# Altium schematic sheet [11]-FPGA_Bank_4_Interface.SchDoc
size A3
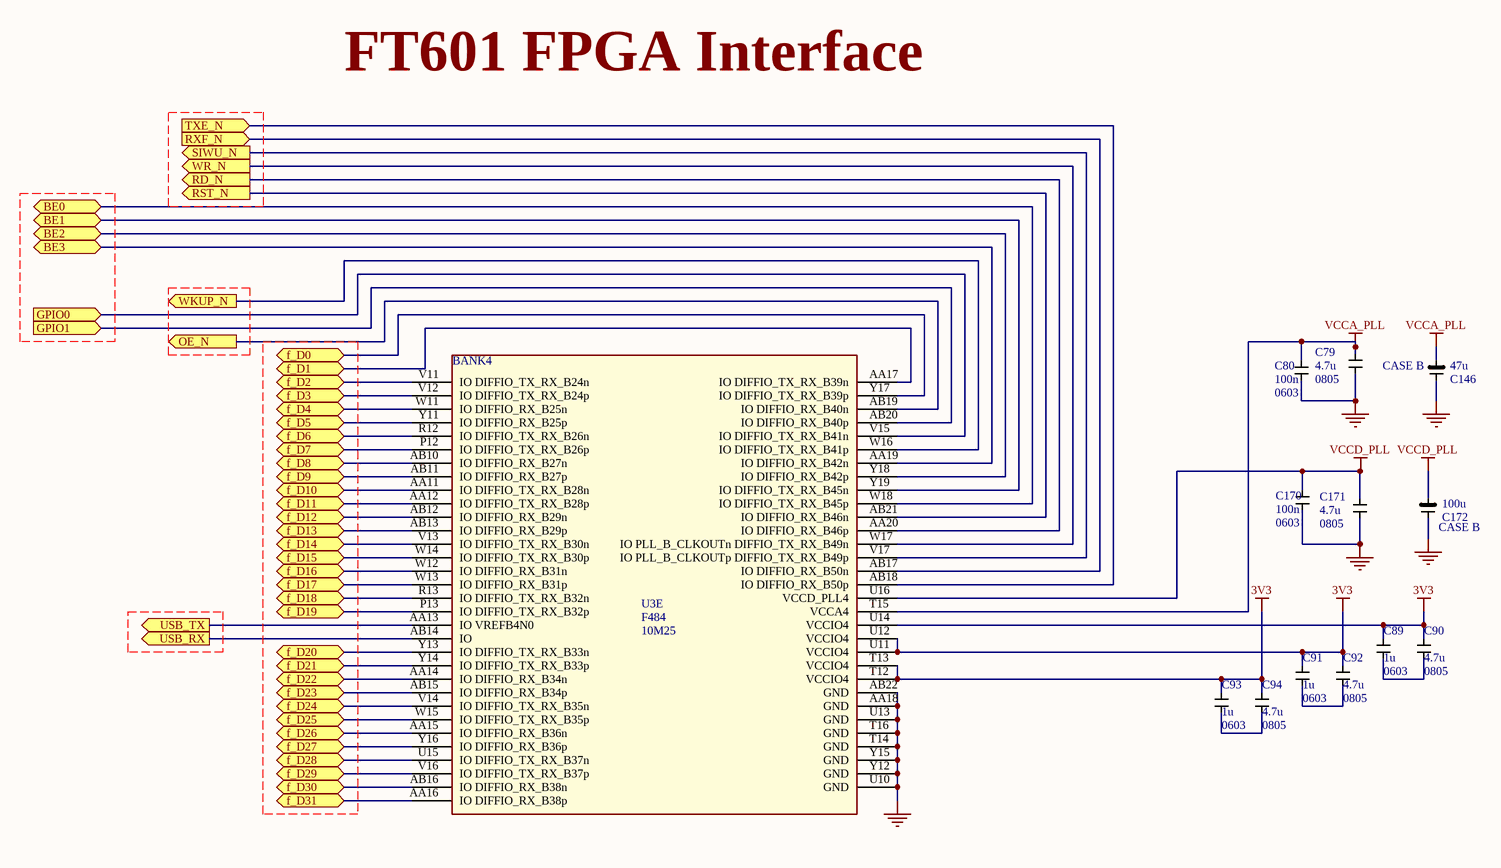
[diagram p0: [11]-FPGA_Bank_4_Interface.SchDoc]

## Parts
C79  4.7u  PCB footprint: 0805
C80  100n  PCB Layer:: 0603  [*0603]
C89  1u  PCB Layer:: 0603  [*0603]
C90  4.7u  PCB Package: 0805  [*CAPC2013X140N]
C91  1u  PCB Layer:: 0603  [*0603]
C92  4.7u  PCB Package: 0805  [*CAPC2013X140N]
C93  1u  PCB Layer:: 0603  [*0603]
C94  4.7u  PCB Package: 0805  [*CAPC2013X140N]
C146  47u  CASE: CASE B  [CAPC3529X21N]
C170  100n  PCB Layer:: 0603  [*0603]
C171  4.7u  PCB footprint: 0805
C172  100u  CASE: CASE B  [CAPC3529X21N]
U3  10M25  Package Type: F484  [*BGA484C100P22X22_2300X2300X200N]  (part E of 9)

## Ports
BE0 (bidir), BE1 (bidir), BE2 (bidir), BE3 (bidir), f_D0 (bidir), f_D1 (bidir), f_D2 (bidir), f_D3 (bidir), f_D4 (bidir), f_D5 (bidir), f_D6 (bidir), f_D7 (bidir), f_D8 (bidir), f_D9 (bidir), f_D10 (bidir), f_D11 (bidir), f_D12 (bidir), f_D13 (bidir), f_D14 (bidir), f_D15 (bidir), f_D16 (bidir), f_D17 (bidir), f_D18 (bidir), f_D19 (bidir), f_D20 (bidir), f_D21 (bidir), f_D22 (bidir), f_D23 (bidir), f_D24 (bidir), f_D25 (bidir), f_D26 (bidir), f_D27 (bidir), f_D28 (bidir), f_D29 (bidir), f_D30 (bidir), f_D31 (bidir), GPIO0 (in), GPIO1 (in), OE_N (out), RD_N (out), RST_N (out), RXF_N (in), SIWU_N (out), TXE_N (in), USB_RX (out), USB_TX (out), WKUP_N (out), WR_N (out)

## Nets
3V3: C89.2 C90.2 C91.2 C92.2 C93.2 C94.2 U3.T12(VCCIO4) U3.T13(VCCIO4) U3.U11(VCCIO4) U3.U12(VCCIO4) U3.U14(VCCIO4)
GND: C79.1 C80.1 C146.2 C170.1 C171.1 C172.2 U3.AA18(GND) U3.AB22(GND) U3.T14(GND) U3.T16(GND) U3.U10(GND) U3.U13(GND) U3.Y12(GND) U3.Y15(GND)
VCCA_PLL: C79.2 C80.2 C146.1 U3.T15(VCCA4)
VCCD_PLL: C170.2 C171.2 C172.1 U3.U16(VCCD_PLL4)
BE0: U3.W18(IO_DIFFIO_TX_RX_B45p) ; port BE0
BE1: U3.Y19(IO_DIFFIO_TX_RX_B45n) ; port BE1
BE2: U3.Y18(IO_DIFFIO_RX_B42p) ; port BE2
BE3: U3.AA19(IO_DIFFIO_RX_B42n) ; port BE3
f_D0: U3.Y17(IO_DIFFIO_TX_RX_B39p) ; port f_D0
f_D1: U3.AA17(IO_DIFFIO_TX_RX_B39n) ; port f_D1
f_D2: U3.V11(IO_DIFFIO_TX_RX_B24n) ; port f_D2
f_D3: U3.V12(IO_DIFFIO_TX_RX_B24p) ; port f_D3
f_D4: U3.W11(IO_DIFFIO_RX_B25n) ; port f_D4
f_D5: U3.Y11(IO_DIFFIO_RX_B25p) ; port f_D5
f_D6: U3.R12(IO_DIFFIO_TX_RX_B26n) ; port f_D6
f_D7: U3.P12(IO_DIFFIO_TX_RX_B26p) ; port f_D7
f_D8: U3.AB10(IO_DIFFIO_RX_B27n) ; port f_D8
f_D9: U3.AB11(IO_DIFFIO_RX_B27p) ; port f_D9
f_D10: U3.AA11(IO_DIFFIO_TX_RX_B28n) ; port f_D10
f_D11: U3.AA12(IO_DIFFIO_TX_RX_B28p) ; port f_D11
f_D12: U3.AB12(IO_DIFFIO_RX_B29n) ; port f_D12
f_D13: U3.AB13(IO_DIFFIO_RX_B29p) ; port f_D13
f_D14: U3.V13(IO_DIFFIO_TX_RX_B30n) ; port f_D14
f_D15: U3.W14(IO_DIFFIO_TX_RX_B30p) ; port f_D15
f_D16: U3.W12(IO_DIFFIO_RX_B31n) ; port f_D16
f_D17: U3.W13(IO_DIFFIO_RX_B31p) ; port f_D17
f_D18: U3.R13(IO_DIFFIO_TX_RX_B32n) ; port f_D18
f_D19: U3.P13(IO_DIFFIO_TX_RX_B32p) ; port f_D19
f_D20: U3.Y13(IO_DIFFIO_TX_RX_B33n) ; port f_D20
f_D21: U3.Y14(IO_DIFFIO_TX_RX_B33p) ; port f_D21
f_D22: U3.AA14(IO_DIFFIO_RX_B34n) ; port f_D22
f_D23: U3.AB15(IO_DIFFIO_RX_B34p) ; port f_D23
f_D24: U3.V14(IO_DIFFIO_TX_RX_B35n) ; port f_D24
f_D25: U3.W15(IO_DIFFIO_TX_RX_B35p) ; port f_D25
f_D26: U3.AA15(IO_DIFFIO_RX_B36n) ; port f_D26
f_D27: U3.Y16(IO_DIFFIO_RX_B36p) ; port f_D27
f_D28: U3.U15(IO_DIFFIO_TX_RX_B37n) ; port f_D28
f_D29: U3.V16(IO_DIFFIO_TX_RX_B37p) ; port f_D29
f_D30: U3.AB16(IO_DIFFIO_RX_B38n) ; port f_D30
f_D31: U3.AA16(IO_DIFFIO_RX_B38p) ; port f_D31
GPIO0: U3.V15(IO_DIFFIO_TX_RX_B41n) ; port GPIO0
GPIO1: U3.AB20(IO_DIFFIO_RX_B40p) ; port GPIO1
OE_N: U3.AB19(IO_DIFFIO_RX_B40n) ; port OE_N
RD_N: U3.AA20(IO_DIFFIO_RX_B46p) ; port RD_N
RST_N: U3.AB21(IO_DIFFIO_RX_B46n) ; port RST_N
RXF_N: U3.AB17(IO_DIFFIO_RX_B50n) ; port RXF_N
SIWU_N: U3.V17(IO_PLL_B_CLKOUTp_DIFFIO_TX_RX_B49p) ; port SIWU_N
TXE_N: U3.AB18(IO_DIFFIO_RX_B50p) ; port TXE_N
USB_RX: U3.AB14(IO) ; port USB_RX
USB_TX: U3.AA13(IO_VREFB4N0) ; port USB_TX
WKUP_N: U3.W16(IO_DIFFIO_TX_RX_B41p) ; port WKUP_N
WR_N: U3.W17(IO_PLL_B_CLKOUTn_DIFFIO_TX_RX_B49n) ; port WR_N
NetC89_1: C89.1 C90.1
NetC91_1: C91.1 C92.1
NetC93_1: C93.1 C94.1

## Notes on the sheet
- FT601 FPGA Interface
- (in symbol Component_1, part E) BANK4

## Library data of the parts
C79 C80 C89-C94 C146 C170-C172 = Component_1
  C79 C171: Buying URL:: NEED TO BE ADDED
  C80 C89 C91 C93 C170: Buying URL:: https://uk.farnell.com/avx/0603yc105kat2a/cap-1-f-16v-10-x7r-0603/dp/1658870RL?st=1u%200603
  C90 C92 C94: Buying URL:: https://uk.farnell.com/avx/08053d475kat2a/cap-4-7-f-25v-10-x5r-0805/dp/1657932?st=4.7u%200805
  C146 C172: Buying URL:: https://uk.farnell.com/avx/tajb107k006tnj/cap-tant-aec-q200-100uf-6-3v-case/dp/2893386?st=100u%20CASE%20B
U3 = Component_1: Part no.: 10M25DAF484I7G